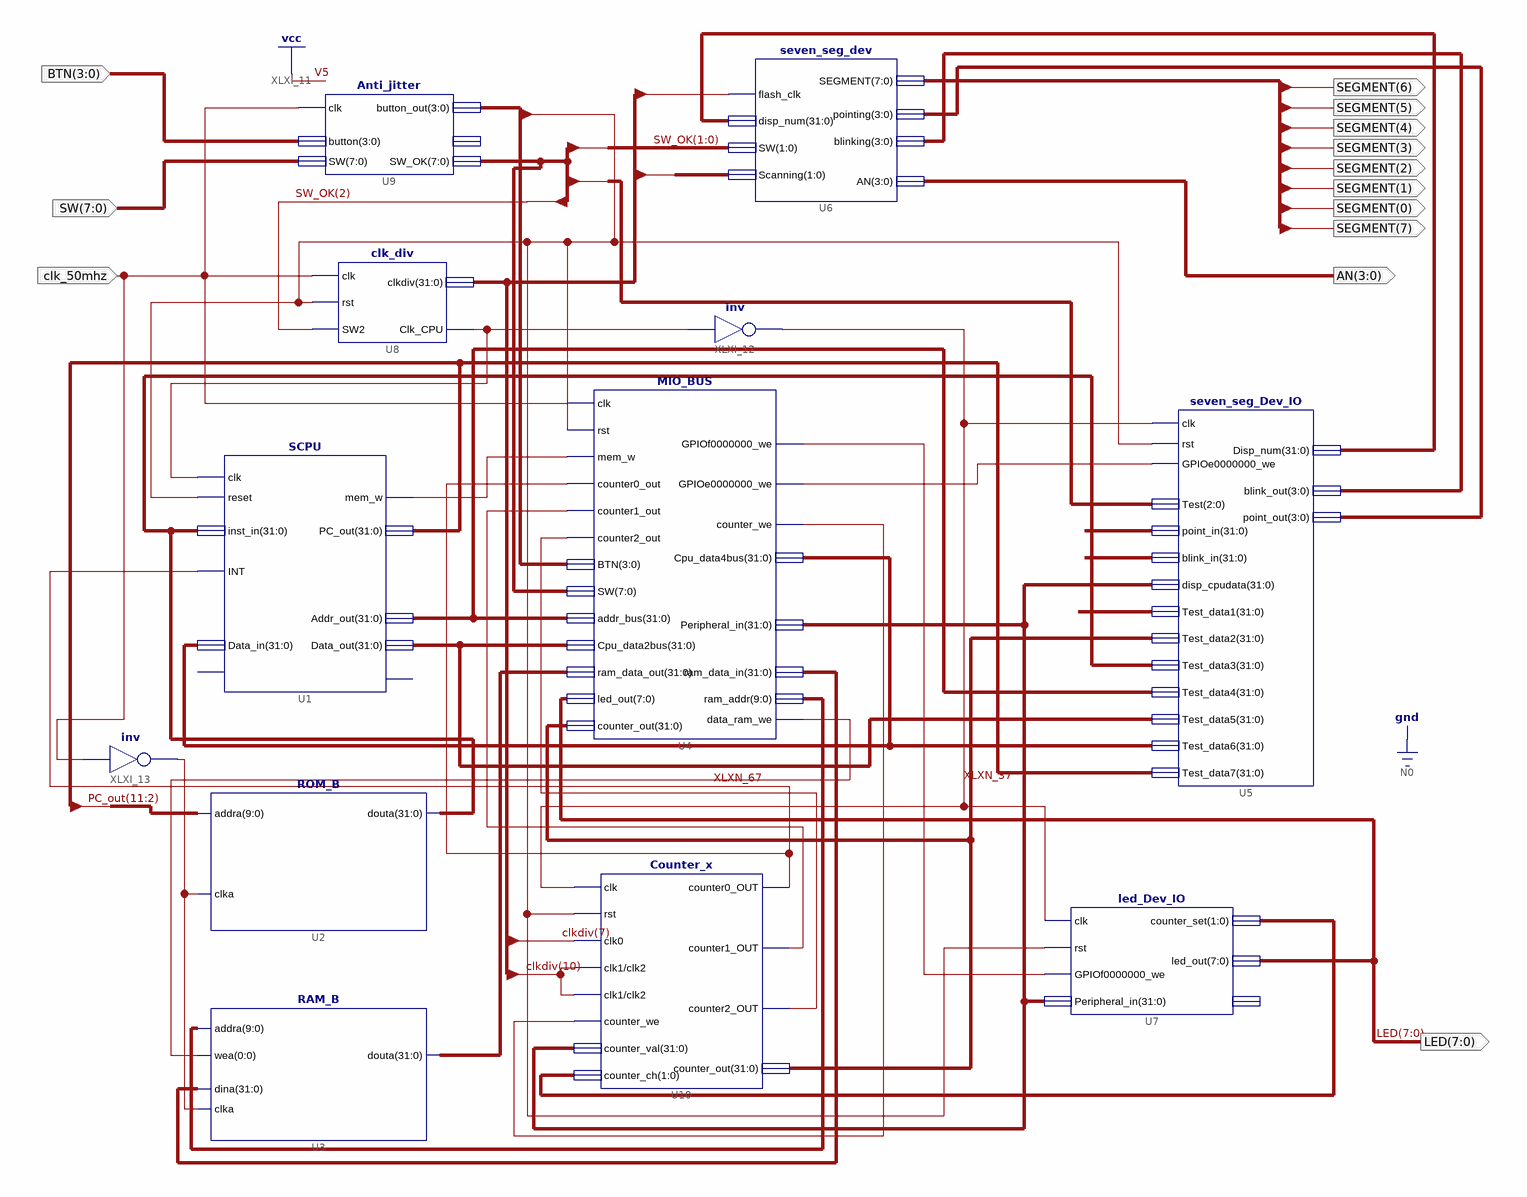
[diagram p0: schematic sheet 1]
// Xilinx ISE schematic Top.sch (spartan6) as structural Verilog: 12 symbols, 13 ports
module Top (
  input  clk_50mhz,
  input  [7:0] SW,
  input  [3:0] BTN,
  output [7:0] SEGMENT,
  output [3:0] AN,
  output [7:0] LED
);

  wire N0, XLXN_37, XLXN_39, XLXN_41, XLXN_45, XLXN_52, XLXN_53, XLXN_60, XLXN_61, XLXN_67, XLXN_72;
  wire [0:0] XLXN_43;
  wire [1:0] XLXN_77;
  wire [3:0] blinke, button_out, XLXN_30, XLXN_31;
  wire [7:0] SW_OK;
  wire [9:0] XLXN_46;
  wire [31:0] clkdiv, PC_out, XLXN_19, XLXN_44, XLXN_57, XLXN_62, XLXN_63, XLXN_64, XLXN_65, XLXN_73, XLXN_78;

  Anti_jitter U9 (
    .clk(clk_50mhz), .SW(SW), .button_out(button_out), .SW_OK(SW_OK), .button(BTN));  // open: button_pulse
  clk_div U8 (.clk(clk_50mhz), .rst(button_out[0]), .SW2(SW_OK[2]), .clkdiv(clkdiv), .Clk_CPU(XLXN_39));
  seven_seg_dev U6 (
    .pointing(XLXN_30), .blinking(XLXN_31), .SW(SW_OK[1:0]), .Scanning(clkdiv[19:18]), .disp_num(XLXN_19),
    .flash_clk(clkdiv[24]), .SEGMENT(SEGMENT), .AN(AN));
  seven_seg_Dev_IO U5 (
    .clk(XLXN_37), .Test(SW_OK[7:5]), .point_in({32{1'b1}}), .blink_in({{24{N0}}, blinke, blinke}),
    .disp_cpudata(XLXN_78), .Test_data1({{2{N0}}, PC_out[31:2]}), .Test_data2(XLXN_73), .Test_data3(XLXN_65),
    .Test_data4(XLXN_62), .Test_data5(XLXN_63), .Test_data6(XLXN_64), .Test_data7(PC_out),
    .blink_out(XLXN_31), .point_out(XLXN_30), .rst(button_out[0]), .GPIOe0000000_we(XLXN_52),
    .Disp_num(XLXN_19));
  led_Dev_IO U7 (
    .clk(XLXN_37), .rst(button_out[0]), .GPIOf0000000_we(XLXN_53), .Peripheral_in(XLXN_78),
    .counter_set(XLXN_77), .led_out(LED));  // open: GPIOf0
  Counter_x U10 (
    .clk(XLXN_37), .rst(button_out[0]), .clk0(clkdiv[7]), .clk1(clkdiv[10]), .clk2(clkdiv[10]),
    .counter_we(XLXN_72), .counter_val(XLXN_78), .counter_ch(XLXN_77), .counter0_OUT(XLXN_67),
    .counter1_OUT(XLXN_60), .counter2_OUT(XLXN_61), .counter_out(XLXN_73));
  MIO_BUS U4 (
    .clk(clk_50mhz), .rst(button_out[0]), .mem_w(XLXN_45), .counter0_out(XLXN_67), .counter1_out(XLXN_60),
    .counter2_out(XLXN_61), .BTN(button_out), .SW(SW_OK), .ram_data_out(XLXN_57), .led_out(LED),
    .counter_out(XLXN_73), .GPIOf0000000_we(XLXN_53), .GPIOe0000000_we(XLXN_52), .counter_we(XLXN_72),
    .ram_data_in(XLXN_44), .data_ram_we(XLXN_43[0]), .ram_addr(XLXN_46), .Cpu_data4bus(XLXN_64),
    .Peripheral_in(XLXN_78), .Cpu_data2bus(XLXN_63), .addr_bus(XLXN_62));
  SCPU U1 (
    .clk(XLXN_39), .INT(XLXN_67), .inst_in(XLXN_65), .reset(button_out[0]), .Data_in(XLXN_64),
    .mem_w(XLXN_45), .PC_out(PC_out), .Addr_out(XLXN_62), .Data_out(XLXN_63));  // open: MIO_ready, CPU_MIO
  ROM_B U2 (.addra(PC_out[11:2]), .clka(XLXN_41), .douta(XLXN_65));
  RAM_B U3 (.addra(XLXN_46), .clka(XLXN_41), .wea(XLXN_43[0]), .dina(XLXN_44), .douta(XLXN_57));
  not XLXI_12 (XLXN_37, XLXN_39);
  not XLXI_13 (XLXN_41, clk_50mhz);
endmodule
